# Altium project pot_carrier.PrjPcb
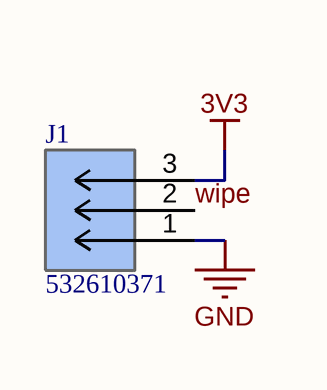
[diagram p0: main.SchDoc]
Board: Potentiometer carrier; Author: Ben Posheng Cheng
1 sheet, 1 parts. Net scope: global (net labels, ports and power ports of the same name join across sheets).
Board file: main.PcbDoc

## Sheet main.SchDoc
size Tabloid; SheetNumber: 1; SheetTotal: 1; Page: Main

### Parts
J1  532610371  [CONN_532610001-SD_03_MOL]

### Nets
3V3: J1.3
GND: J1.1
wipe: J1.2

### Notes on the sheet
- Board
- Page
- Author
- Date:
- File:

### Library data of the parts
J1 = 532610371: 1.25mm Pitch, PicoBlade PCB Header, Single Row, Right-Angle, Surface Mount, Tin (Sn) Plating, Friction Lock, 3 Circuits, Natural, Tape and Reel; Manufacturer_Name: Molex Connector Corporation; Copyright: Copyright (C) 2025 Ultra Librarian. All rights reserved.; Manufacturer_Part_Number: 532610371; RefDes: RefDes; Type: Type